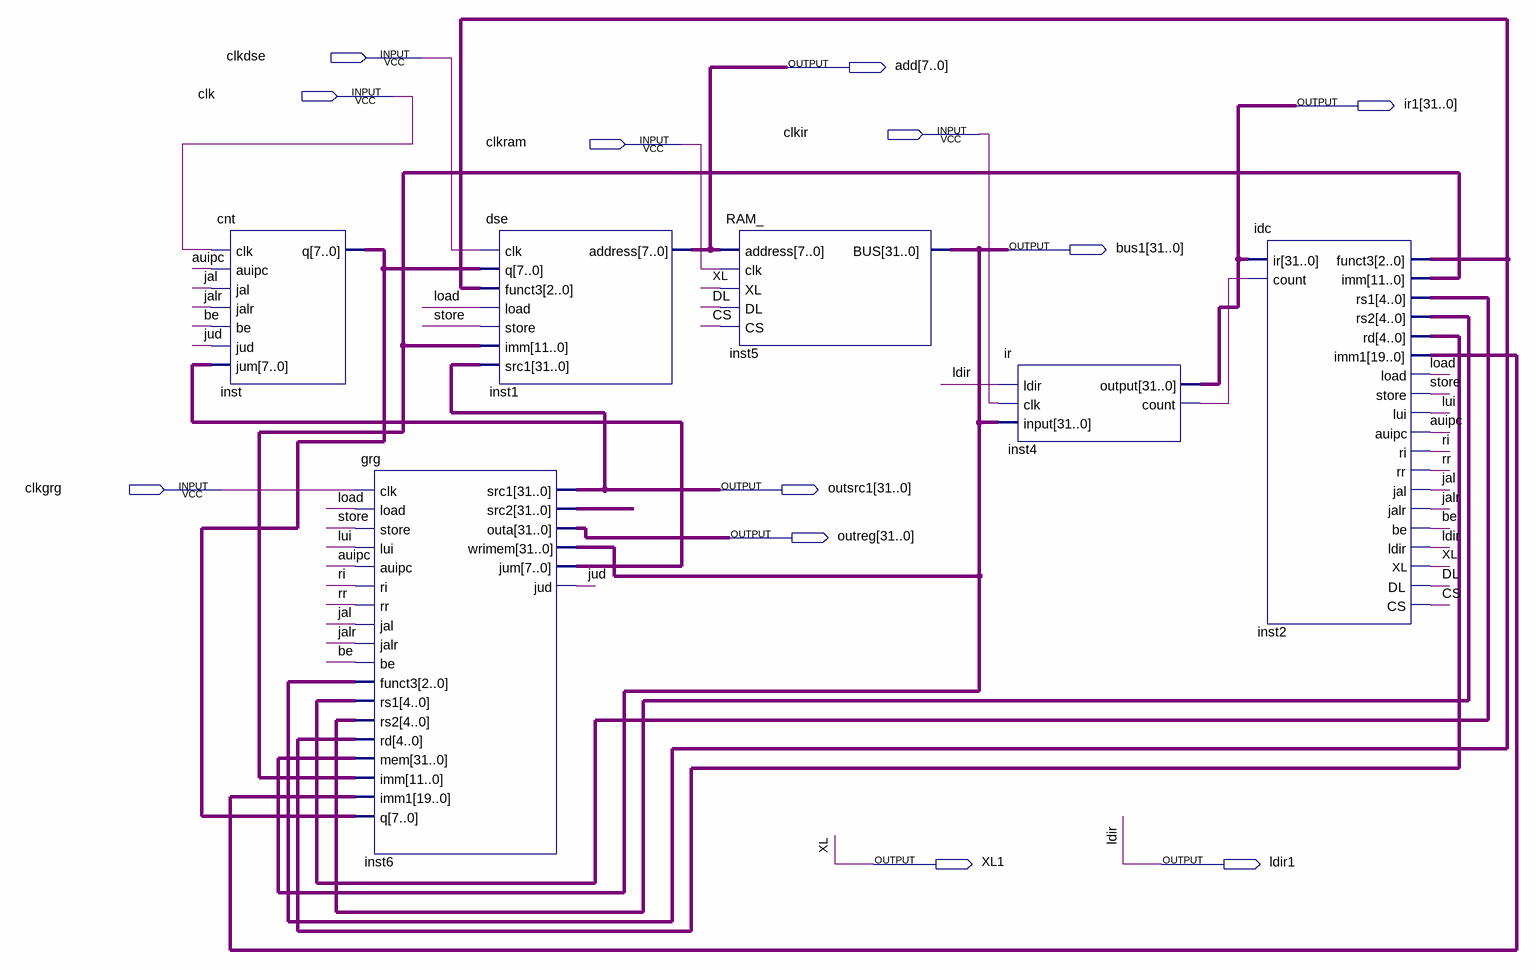
[diagram p0: schematic sheet]
// Quartus schematic cpu1.bdf as structural Verilog: 6 symbols, 12 pins
module cpu1 (
  input  clkdse,
  input  clk,
  input  clkir,
  input  clkram,
  input  clkgrg,
  output [7:0] add,
  output [31:0] ir1,
  output [31:0] bus1,
  output [31:0] outsrc1,
  output [31:0] outreg,
  output XL1,
  output ldir1
);

  wire auipc, be, CS, DL, inst4_count, jal, jalr, jud, load, lui, ri, rr, store;
  wire [2:0] inst2_funct3;
  wire [4:0] inst2_rd, inst2_rs1, inst2_rs2;
  wire [7:0] inst6_jum, inst_q;
  wire [11:0] inst2_imm;
  wire [19:0] inst2_imm1;
  wire [31:0] inst6_src2;

  cnt inst (.clk(clk), .auipc(auipc), .jal(jal), .jalr(jalr), .be(be), .jud(jud), .jum(inst6_jum), .q(inst_q));
  grg inst6 (
    .clk(clkgrg), .load(load), .store(store), .lui(lui), .auipc(auipc), .ri(ri), .rr(rr), .jal(jal),
    .jalr(jalr), .be(be), .funct3(inst2_funct3), .rs1(inst2_rs1), .rs2(inst2_rs2), .rd(inst2_rd), .mem(bus1),
    .imm(inst2_imm), .imm1(inst2_imm1), .q(inst_q), .src1(outsrc1), .src2(inst6_src2), .outa(outreg),
    .wrimem(bus1), .jum(inst6_jum), .jud(jud));
  dse inst1 (
    .clk(clkdse), .q(inst_q), .funct3(inst2_funct3), .load(load), .store(store), .imm(inst2_imm),
    .src1(outsrc1), .address(add));
  RAM_ inst5 (.address(add), .clk(clkram), .XL(XL1), .DL(DL), .CS(CS), .BUS(bus1));
  ir inst4 (.ldir(ldir1), .clk(clkir), .\input (bus1), .\output (ir1), .count(inst4_count));
  idc inst2 (
    .ir(ir1), .count(inst4_count), .funct3(inst2_funct3), .imm(inst2_imm), .rs1(inst2_rs1), .rs2(inst2_rs2),
    .rd(inst2_rd), .imm1(inst2_imm1), .load(load), .store(store), .lui(lui), .auipc(auipc), .ri(ri), .rr(rr),
    .jal(jal), .jalr(jalr), .be(be), .ldir(ldir1), .XL(XL1), .DL(DL), .CS(CS));

  // Other names for the same wires on the sheet: ldir = ldir1; XL = XL1
endmodule
